# EasyEDA Pro project ProProject_stm32F103c8t6_car_board_2024-08-25.epro

# Schematic Schematic1
Create Date: 2024-07-04; Page Name: P1; Project Name: stm32F103c8t6_car_board; Schematic Name: Schematic1; Update Date: 2024-07-08; Company: 嘉立创EDA; Page Size: A4; Version: V1.0
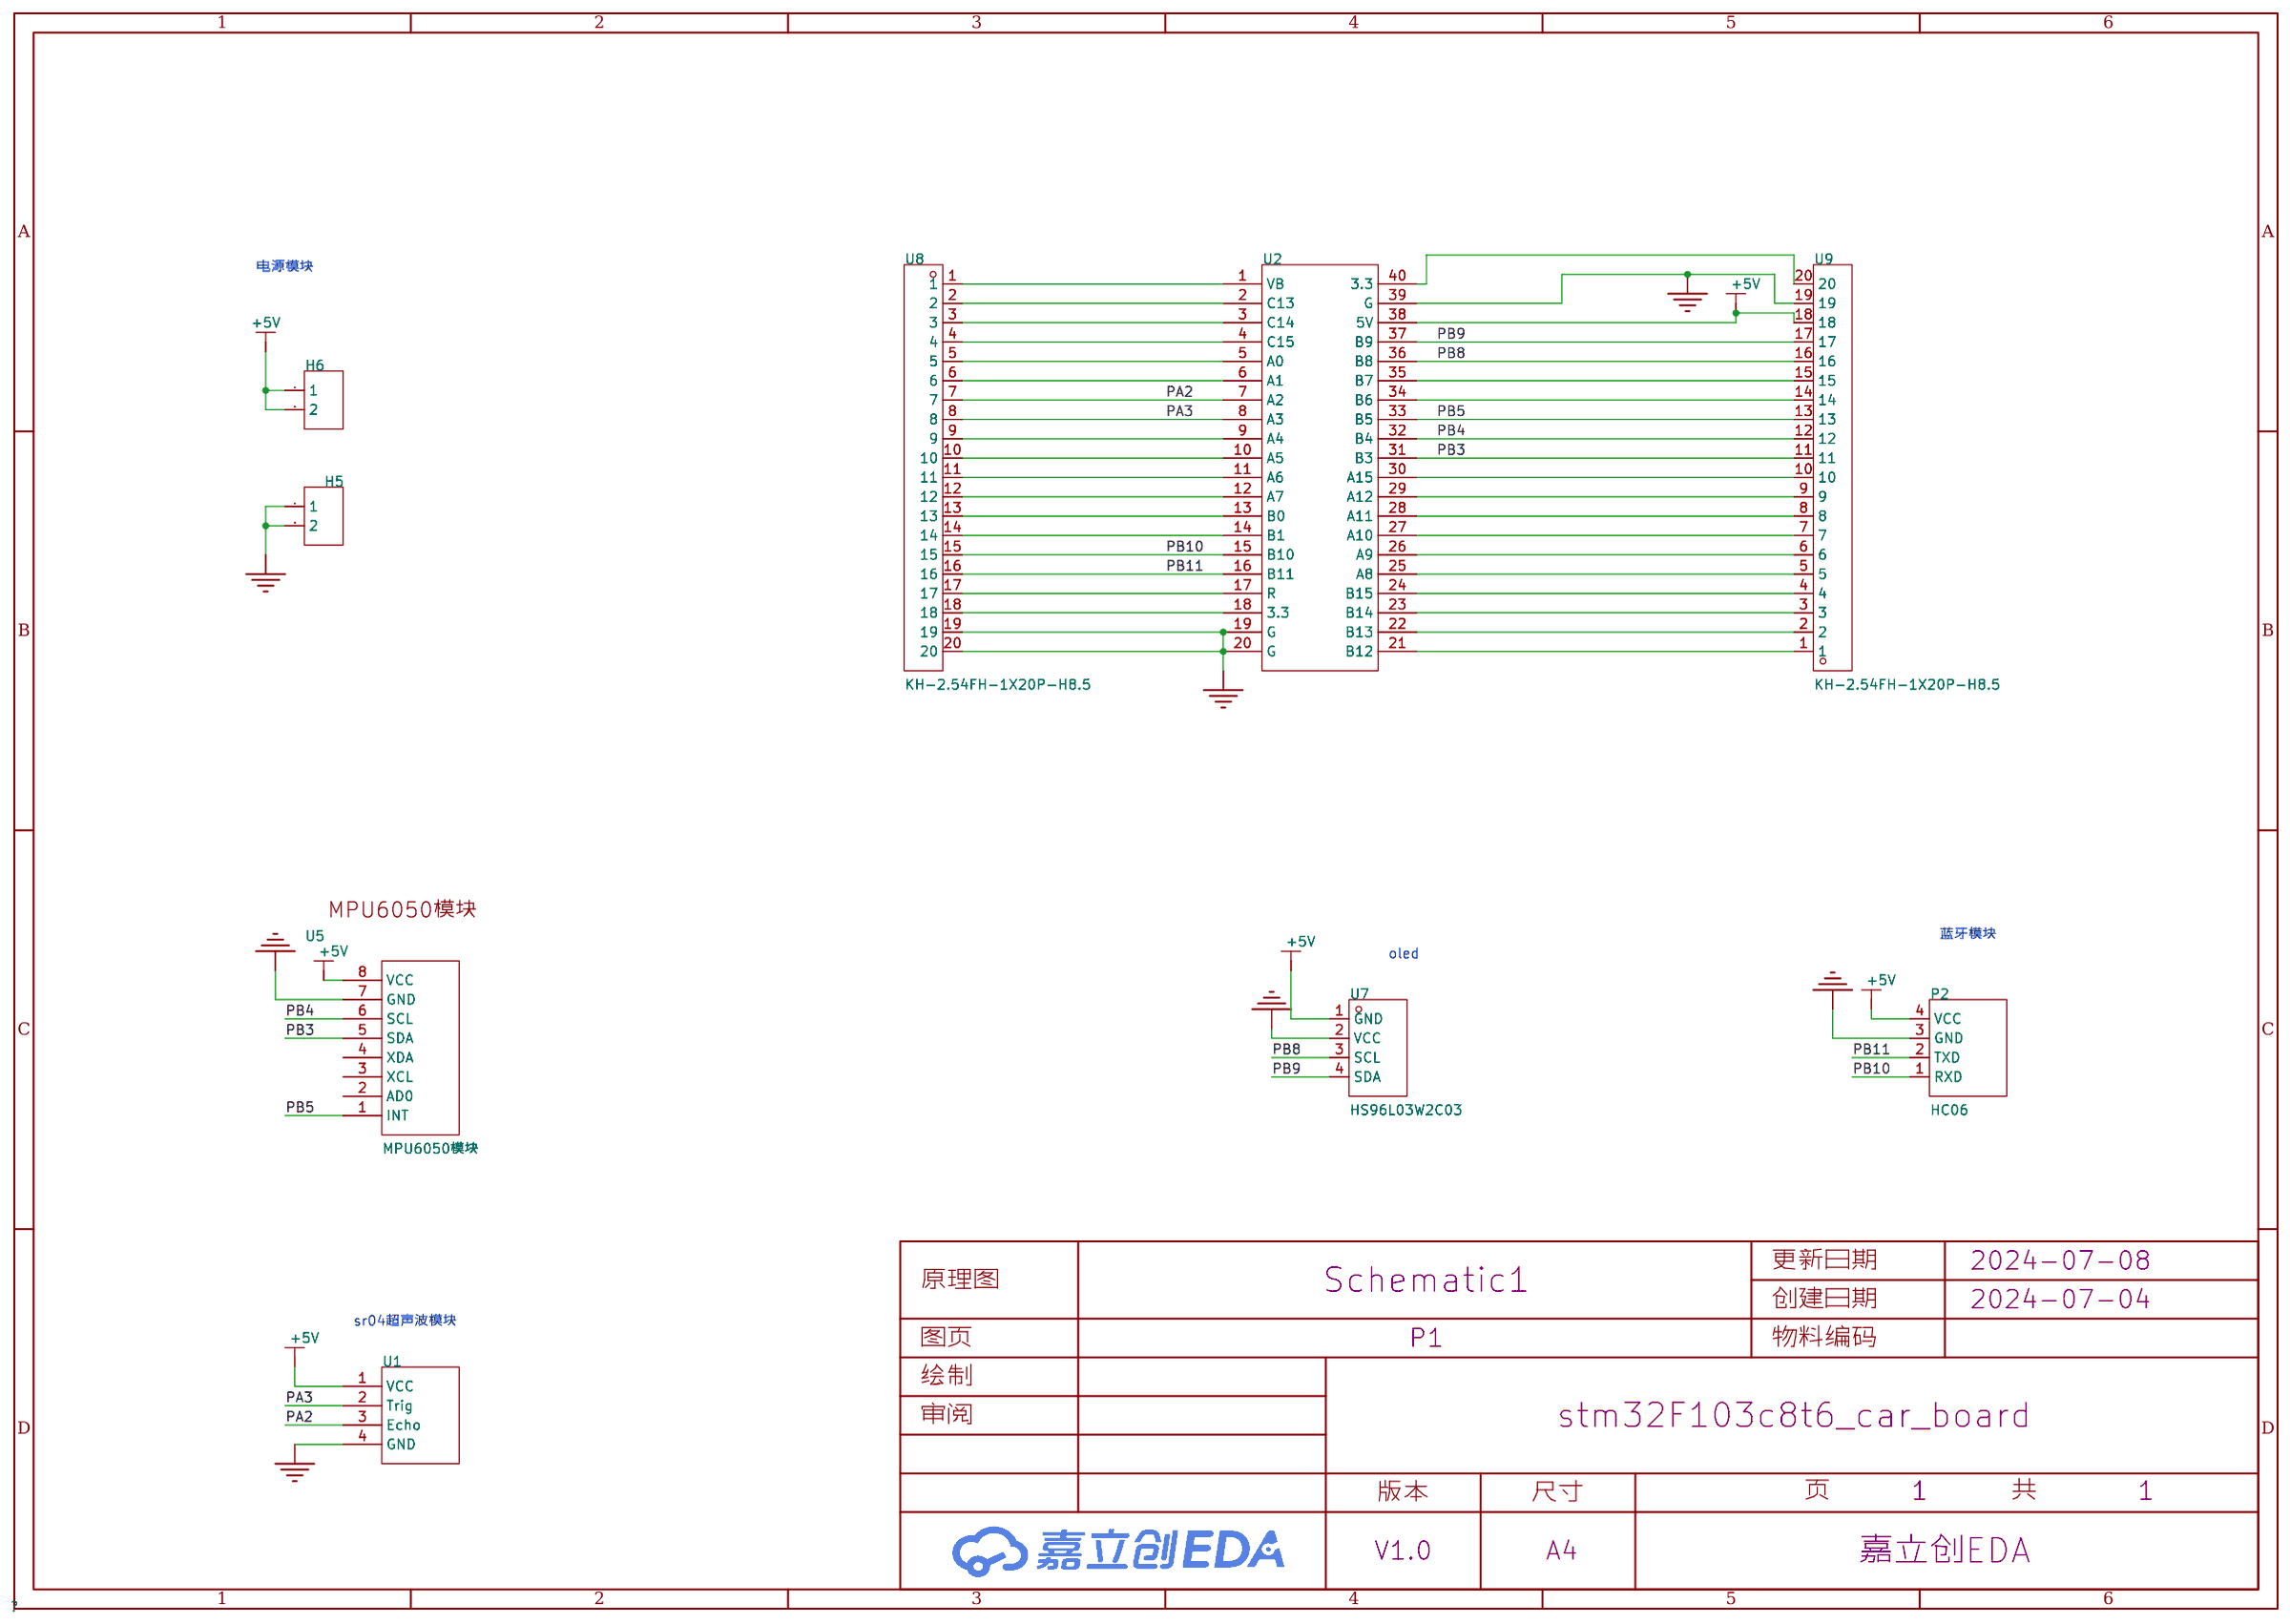
[diagram p0: schematic sheet]

## Parts
H5  -  [HDR-TH_2P-P2.54-V-F]
H6  -  [HDR-TH_2P-P2.54-V-F]
P2  HC06  [HC06]
U1  -  [HCSR04]
U2  -  [STM32C8T6]
U5  MPU6050模块  [MPU6050]
U7  HS96L03W2C03  [OLED-TH_L27.8-W27.2-P2.54_C9900033791]
U8  KH-2.54FH-1X20P-H8.5  [HDR-TH_20P-P2.54-V-F-2]
U9  KH-2.54FH-1X20P-H8.5  [HDR-TH_20P-P2.54-V-F-2]

## Library data of the parts
H5 H6 = HDR-F_2.54_1x2P: Supplier Part: C49661; Supplier Footprint: 插件
P2 = HC06: _: 3
U1 = HCSR04: _: 3
U2 = STM32C8T6
U5 = MPU6050模块
U7 = OLED-4PIN: 主控芯片:SSD1315;接口类型:I2C;尺寸(inch):0.96;像素分辨率:128x64;; LCSC Part Name: 0.96寸OLED显示屏窄白光IIC; Supplier Part: C5248080; Manufacturer: HS(汉昇); JLCPCB Part Class: 扩展库; Datasheet: https://atta.szlcsc.com/upload/public/pdf/source/20230627/763D01F79A90007632F098068C7C8AD9.pdf; Supplier: LCSC; Main Control Chip: SSD1315; Interface Type: I2C; Size: 0.96; Pixel Resolution: 128x64; Operating Temperature: -40℃~+70℃
U8 U9 = KH-2.54FH-1X20P-H8.5: 插孔结构:1x20P;间距:2.54mm;行距:-;圆孔/方孔:方孔;安装类型:直插;排数:单排;总孔位数:20P;额定电流:3A;额定电压:-;插孔方向:顶部;塑高:8.5mm;工作温度范围:-40℃~+105℃;; LCSC Part Name: 间距:2.54mm 1x20P 直插; Supplier Part: C2905423; Manufacturer: kinghelm(金航标); Supplier Footprint: 插件,P=2.54mm; JLCPCB Part Class: 扩展库; Datasheet: https://atta.szlcsc.com/upload/public/pdf/source/20211019/BDB673907948473CE61C8A1CF06C5BF5.pdf; Supplier: LCSC; Holes Structure: 1x20P; Pitch: 2.54mm; Circular Hole / Square Hole: 方孔; Mounting Type: 直插; Number of Rows: 单排; Number of Holes: 20P; Current Rating (Max): 3A; Holes Direction: 顶部; Insulation Height: 8.5mm; Operating Temperature Range: -40℃~+105℃

## Nets
+5V: H6.1 H6.2 P2.4(VCC) U1.1(VCC) U2.38(5V) U5.8(VCC) U7.1(GND) U9.18
GND: H5.1 H5.2 P2.3(GND) U1.4(GND) U2.19(G) U2.20(G) U2.39(G) U5.7(GND) U7.2(VCC) U8.19 U8.20 U9.19
PA2: U1.3(Echo) U2.7(A2) U8.7
PA3: U1.2(Trig) U2.8(A3) U8.8
PB3: U2.31(B3) U5.5(SDA) U9.11
PB4: U2.32(B4) U5.6(SCL) U9.12
PB5: U2.33(B5) U5.1(INT) U9.13
PB8: U2.36(B8) U7.3(SCL) U9.16
PB9: U2.37(B9) U7.4(SDA) U9.17
PB10: P2.1(RXD) U2.15(B10) U8.15
PB11: P2.2(TXD) U2.16(B11) U8.16
$1N3111: U2.1(VB) U8.1
$1N3114: U2.2(C13) U8.2
$1N3119: U2.3(C14) U8.3
$1N3124: U2.4(C15) U8.4
$1N3129: U2.5(A0) U8.5
$1N3134: U2.6(A1) U8.6
$1N3149: U2.9(A4) U8.9
$1N3154: U2.10(A5) U8.10
$1N3159: U2.11(A6) U8.11
$1N3164: U2.12(A7) U8.12
$1N3169: U2.13(B0) U8.13
$1N3174: U2.14(B1) U8.14
$1N3189: U2.17(R) U8.17
$1N3194: U2.18(3.3) U8.18
$1N3205: U2.40(3.3) U9.20
$1N3264: U2.35(B7) U9.15
$1N3275: U2.34(B6) U9.14
$1N3295: U2.30(A15) U9.10
$1N3300: U2.29(A12) U9.9
$1N3305: U2.28(A11) U9.8
$1N3310: U2.27(A10) U9.7
$1N3315: U2.26(A9) U9.6
$1N3323: U2.25(A8) U9.5
$1N3328: U2.24(B15) U9.4
$1N3333: U2.23(B14) U9.3
$1N3338: U2.22(B13) U9.2
$1N3350: U2.21(B12) U9.1

Not connected (* = marked no-connect by the designer): U5 2(AD0) 3(XCL) 4(XDA)

## Notes on the sheet
- 电源模块
- oled
- 蓝牙模块
- sr04超声波模块

# Board PCB2
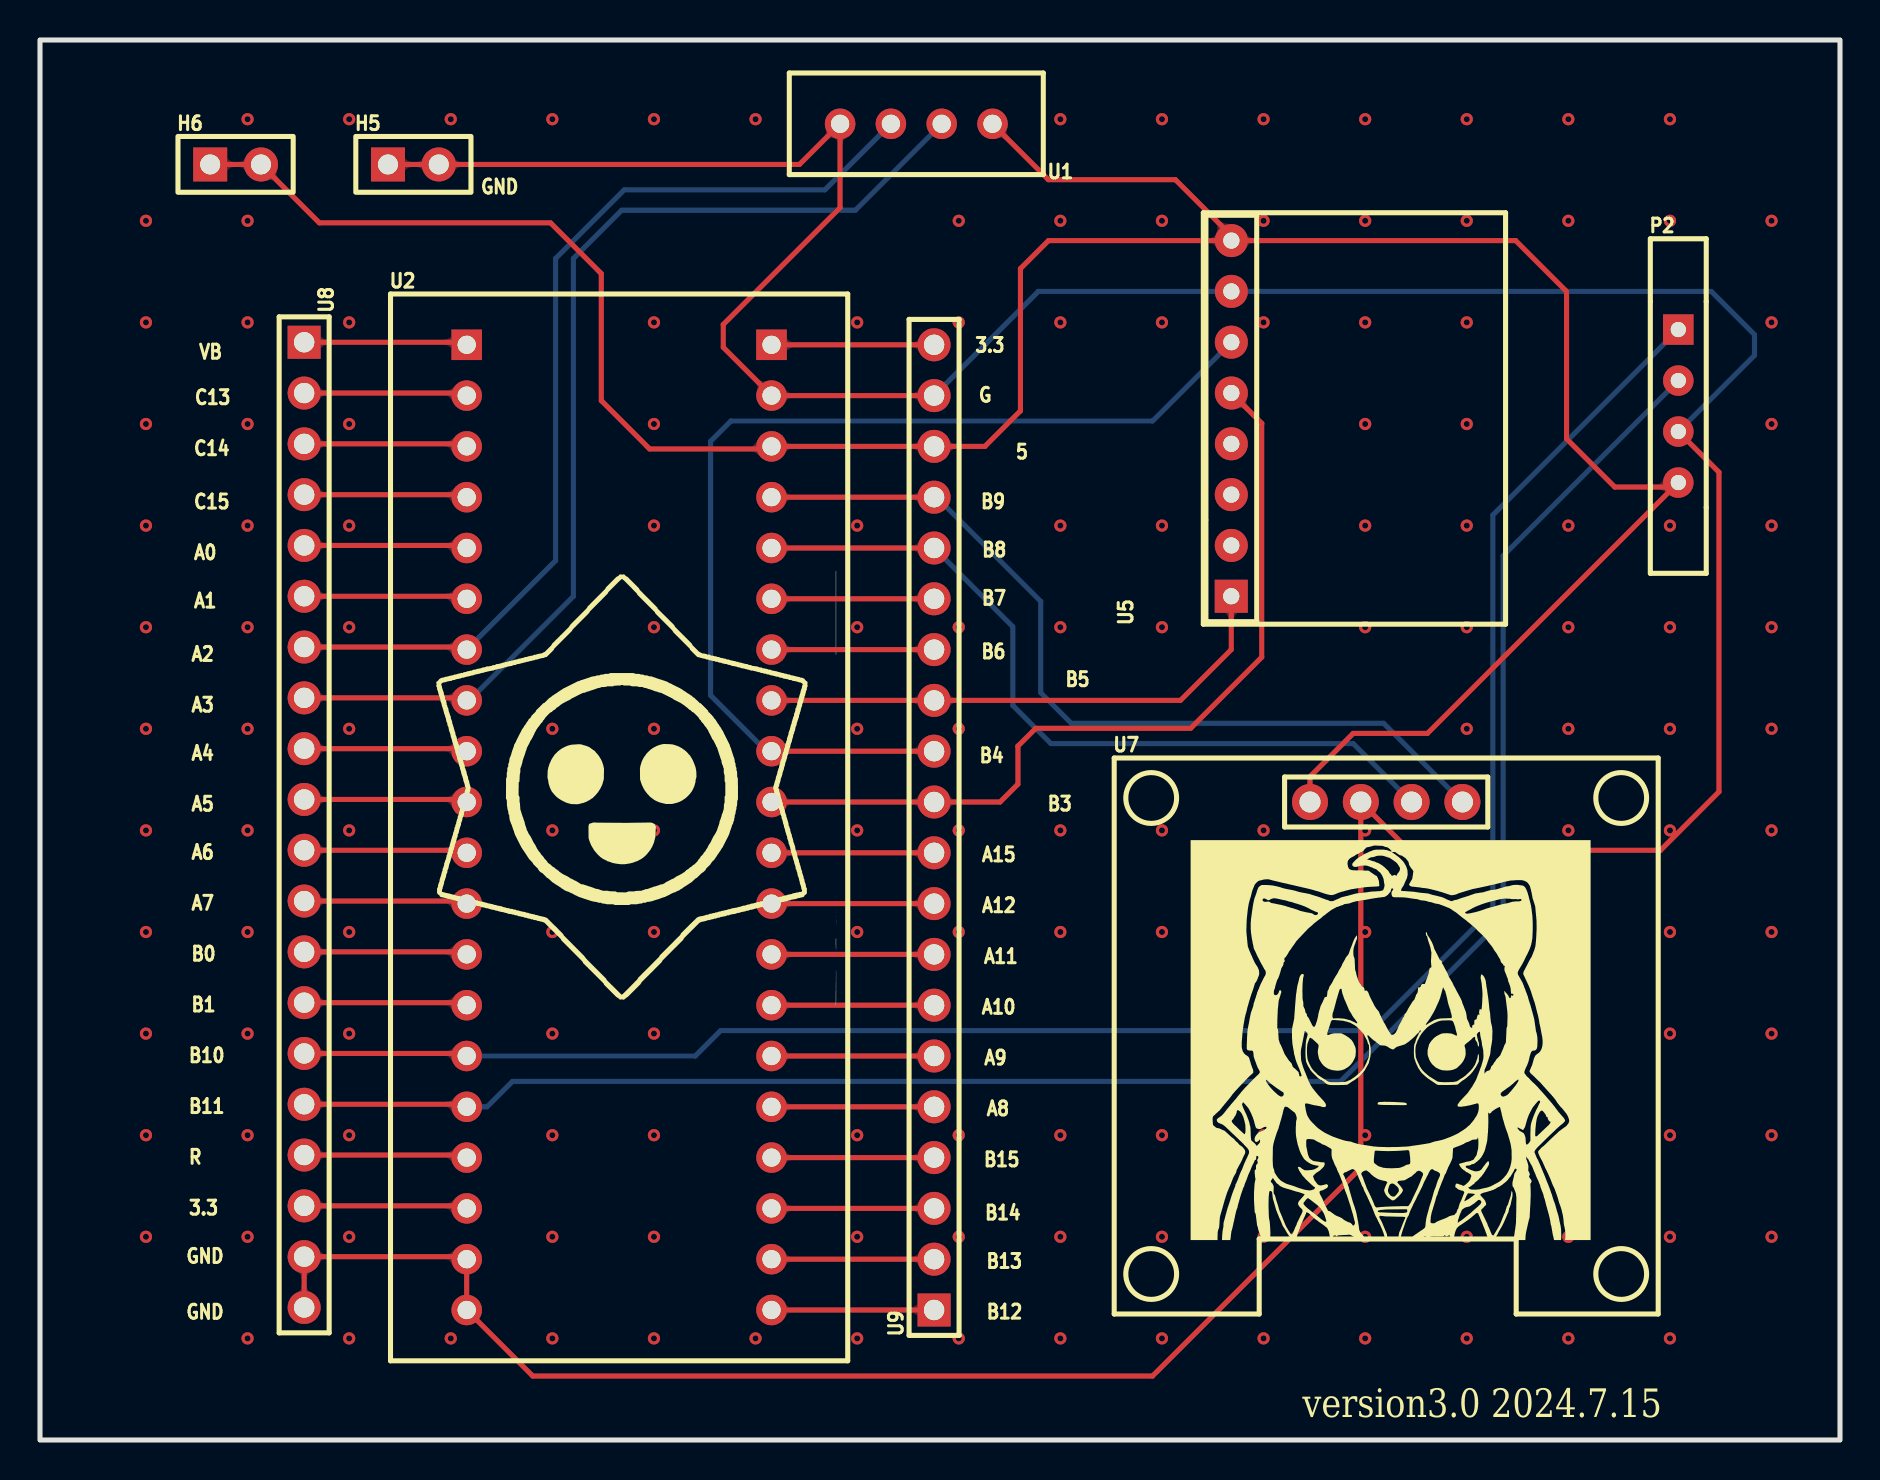
[diagram p1: board, top side]
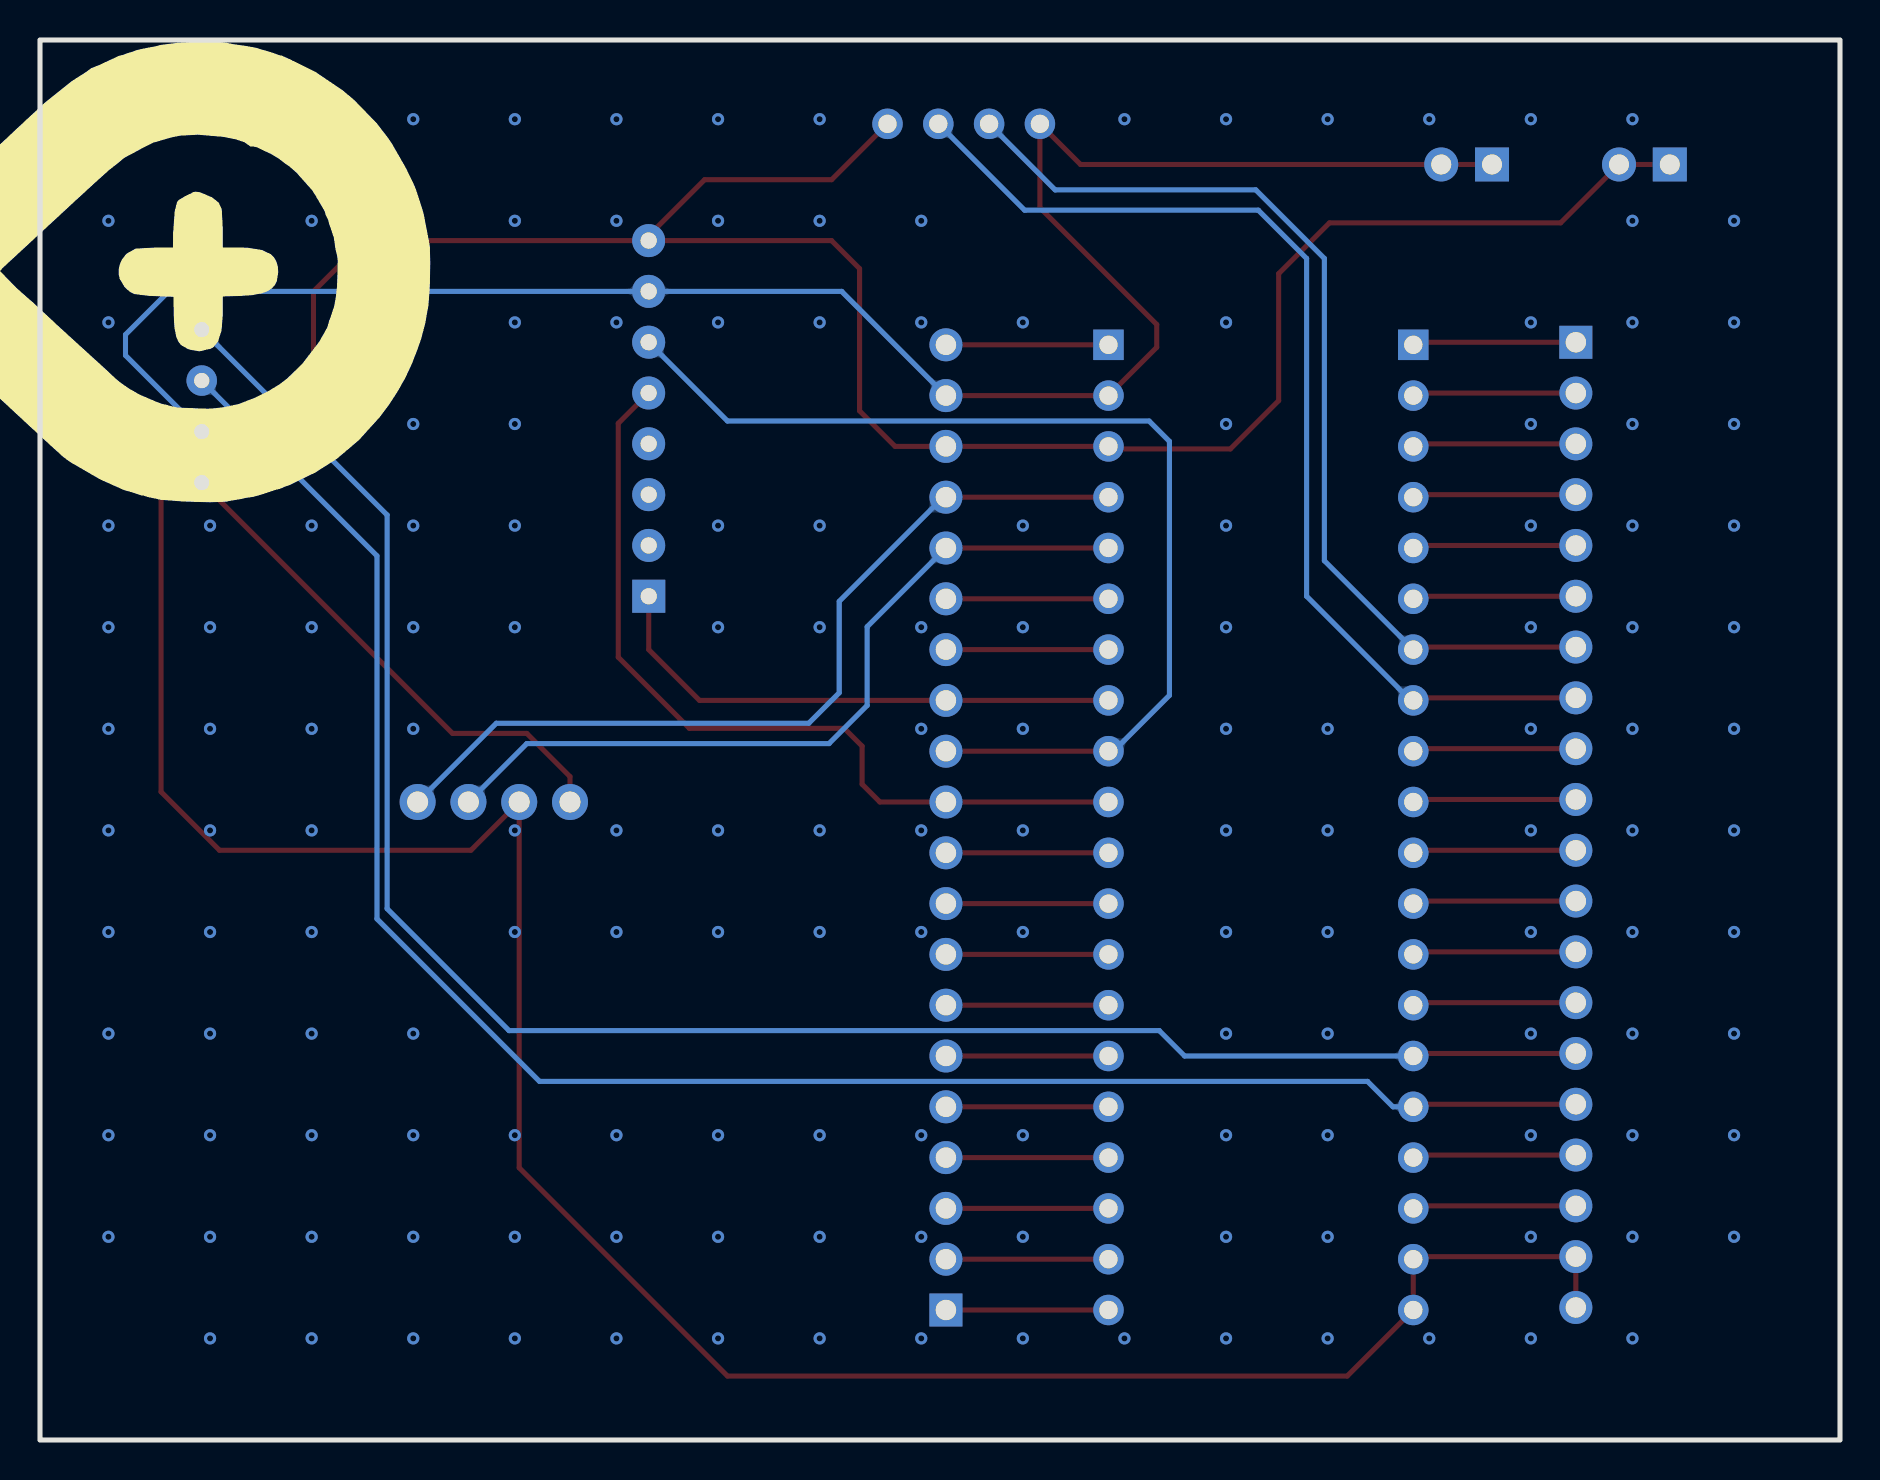
[diagram p2: board, bottom side, seen from below]

Outline 90 x 70 mm; copper layers: Top Layer, Bottom Layer. Coordinates in mm from the lower left corner of the outline.
Outline path: rectangle 0,70 90,0
Stack: Top Layer 0.035mm / Dielectric1 1.51mm FR4 er 4.5 / Bottom Layer 0.035mm

## Design rules (mm)
template: JLCPCB Capability(Two Layers Board)
spacing copperThickness1oz (default): track to track 0.102, other pairs 0.152 to 0.3
spacing copperThickness2oz: track to track 0.203, other pairs 0.152 to 0.3
track width copperThickness1oz (default): min 0.127, default 0.254, max 2.54
track width copperThickness2oz: min 0.203, default 0.254, max 2.54
differential pair differentialPair (default): width min 0.127, default 0.254, max 2.54; gap min 0.152, default 0.152
via viaSize (default): diameter min 0.5, default 0.61, max 10; hole min 0.3, default 0.305, max 6.3

## Placement (name value [footprint] x y rotation side)
H5  -  [HDR-TH_2P-P2.54-V-F]  18.67 63.78 0 top
H6  -  [HDR-TH_2P-P2.54-V-F]  9.78 63.78 0 top
P2  -  [HC06]  81.91 55.52 0 top
U1  -  [HCSR04]  47.62 65.81 180 top
U2  -  [STM32C8T6]  21.34 54.76 0 top
U5  MPU6050模块  [MPU6050]  58.17 40.79 90 top
U7  HS96L03W2C03  [OLED-TH_L27.8-W27.2-P2.54_C9900033791]  67.31 31.9 0 top
U8  KH-2.54FH-1X20P-H8.5  [HDR-TH_20P-P2.54-V-F-2]  13.21 30.76 270 top
U9  KH-2.54FH-1X20P-H8.5  [HDR-TH_20P-P2.54-V-F-2]  44.7 30.63 90 top

## Footprints (pads in the part's own frame, mm; a bottom-side part is the same pattern mirrored in y, then rotated)
HC06
  rect 1.524x1.524 hole 0.762: 1(0,0)
  round 1.524 hole 0.762: 2(0,-2.55) 3(0,-5.1) 4(0,-7.65)
HCSR04
  round 1.524 hole 0.914: 1(0,0) 2(2.54,0) 3(5.08,0) 4(7.62,0)
HDR-TH_2P-P2.54-V-F
  rect 1.7x1.7 hole 1: 1(-1.27,0)
  round 1.7 hole 1: 2(1.27,0)
HDR-TH_20P-P2.54-V-F-2
  rect 1.65x1.65 hole 1.02: 1(-24.13,0)
  round 1.65 hole 1.02: 2(-21.59,0) 3(-19.05,0) 4(-16.51,0) 5(-13.97,0) 6(-11.43,0) 7(-8.89,0) 8(-6.35,0) 9(-3.81,0) 10(-1.27,0) 11(1.27,0) 12(3.81,0) 13(6.35,0) 14(8.89,0) 15(11.43,0) 16(13.97,0) 17(16.51,0) 18(19.05,0) 19(21.59,0) 20(24.13,0)
MPU6050
  rect 1.651x1.651 hole 0.81: 1(1.397,-1.397)
  round 1.651 hole 0.81: 2(3.938,-1.399) 3(6.478,-1.399) 4(9.021,-1.401) 5(11.56,-1.401) 6(14.101,-1.401) 7(16.64,-1.401) 8(19.18,-1.401)
OLED-TH_L27.8-W27.2-P2.54_C9900033791
  round 1.8 hole 1.05: 1(-3.81,0) 2(-1.27,0) 3(1.27,0) 4(3.81,0)
STM32C8T6
  rect 1.524x1.524 hole 0.914: 1(0,0) 40(15.24,0)
  round 1.524 hole 0.914: 2(0,-2.54) 3(0,-5.08) 4(0,-7.62) 5(0,-10.16) 6(0,-12.7) 7(0,-15.24) 8(0,-17.78) 9(0,-20.32) 10(0,-22.86) 11(0,-25.4) 12(0,-27.94) 13(0,-30.48) 14(0,-33.02) 15(0,-35.56) 16(0,-38.1) 17(0,-40.64) 18(0,-43.18) 19(0,-45.72) 20(0,-48.26) 21(15.24,-48.26) 22(15.24,-45.72) 23(15.24,-43.18) 24(15.24,-40.64) 25(15.24,-38.1) 26(15.24,-35.56) 27(15.24,-33.02) 28(15.24,-30.48) 29(15.24,-27.94) 30(15.24,-25.4) 31(15.24,-22.86) 32(15.24,-20.32) 33(15.24,-17.78) 34(15.24,-15.24) 35(15.24,-12.7) 36(15.24,-10.16) 37(15.24,-7.62) 38(15.24,-5.08) 39(15.24,-2.54)

## Nets
As in the schematic.

Pads without a net: U5 2 3 4

## Via types
v1: diameter 0.61, hole 0.304, Top Layer to Bottom Layer, 161 vias

## Routing (per net, layer and track width the routed paths; a pad name or vN(x,y) marks a point on that pad's centre or on a via; arc(x,y) is an arc through that point)
+5V: length 141
  Top Layer w0.254: U1.1 50.42,63.02 56.77,63.02 59.57,60.22 U5.8 ; 81.69,47.65 69.37,35.33 65.66,35.33 63.5,33.17 U7.1 ; 81.69,47.65 P2.4 ; 81.69,47.65 78.74,47.65 76.33,50.06 76.33,57.43 73.78,59.97 U5.8 ; U5.8 50.42,59.97 49.02,58.57 49.02,51.46 47.24,49.68 U9.18 U2.38 36.45,49.55 30.48,49.55 28.07,51.97 28.07,58.32 25.53,60.86 13.97,60.86 H6.2 H6.1
GND: length 220
  Top Layer w0.254: U9.19 U2.39 34.16,54.63 34.16,55.78 40,61.62 U1.4 37.97,63.78 H5.2 H5.1 ; P2.3 83.95,48.39 83.95,32.41 81.03,29.49 68.45,29.49 U7.2 66.04,13.61 55.63,3.2 24.64,3.2 U2.20 U2.19 21.21,9.17 U8.19 U8.20
  Bottom Layer w0.254: U9.19 49.91,57.43 U5.7 83.56,57.43 85.72,55.27 85.72,54.23 P2.3
  vias: v1(5.3,60.96) v1(5.3,55.88) v1(5.3,50.8) v1(5.3,45.72) v1(5.3,40.64) v1(5.3,35.56) v1(5.3,30.48) v1(5.3,25.4) v1(5.3,20.32) v1(5.3,15.24) v1(5.3,10.16) v1(10.38,66.04) v1(10.38,60.96) v1(10.38,55.88) v1(10.38,50.8) v1(10.38,45.72) v1(10.38,40.64) v1(10.38,35.56) v1(10.38,30.48) v1(10.38,25.4) v1(10.38,20.32) v1(10.38,15.24) v1(10.38,10.16) v1(10.38,5.08) v1(15.46,66.04) v1(15.46,55.88) v1(15.46,50.8) v1(15.46,45.72) v1(15.46,40.64) v1(15.46,35.56) v1(15.46,30.48) v1(15.46,25.4) v1(15.46,20.32) v1(15.46,15.24) v1(15.46,10.16) v1(15.46,5.08) v1(20.54,66.04) v1(20.54,5.08) v1(25.62,66.04) v1(25.62,35.56) v1(25.62,30.48) v1(25.62,25.4) v1(25.62,20.32) v1(25.62,15.24) v1(25.62,10.16) v1(25.62,5.08) v1(30.7,66.04) v1(30.7,55.88) v1(30.7,50.8) v1(30.7,45.72) v1(30.7,40.64) v1(30.7,35.56) v1(30.7,30.48) v1(30.7,25.4) v1(30.7,20.32) v1(30.7,15.24) v1(30.7,10.16) v1(30.7,5.08) v1(35.78,66.04) v1(35.78,5.08) v1(40.86,55.88) v1(40.86,45.72) v1(40.86,40.64) v1(40.86,35.56) v1(40.86,30.48) v1(40.86,25.4) v1(40.86,15.24) v1(40.86,10.16) v1(40.86,5.08) v1(45.94,60.96) v1(45.94,55.88) v1(45.94,40.64) v1(45.94,35.56) v1(45.94,30.48) v1(45.94,25.4) v1(45.94,15.24) v1(45.94,10.16) v1(45.94,5.08) v1(51.02,66.04) v1(51.02,60.96) v1(51.02,55.88) v1(51.02,45.72) v1(51.02,40.64) v1(51.02,30.48) v1(51.02,25.4) v1(51.02,15.24) v1(51.02,10.16) v1(51.02,5.08) v1(56.1,66.04) v1(56.1,60.96) v1(56.1,55.88) v1(56.1,45.72) v1(56.1,40.64) v1(56.1,30.48) v1(56.1,25.4) v1(56.1,15.24) v1(56.1,10.16) v1(56.1,5.08) v1(61.18,66.04) v1(61.18,60.96) v1(61.18,55.88) v1(61.18,30.48) v1(61.18,25.4) v1(61.18,15.24) v1(61.18,10.16) v1(61.18,5.08) v1(66.26,66.04) v1(66.26,60.96) v1(66.26,55.88) v1(66.26,50.8) v1(66.26,45.72) v1(66.26,40.64) v1(66.26,30.48) v1(66.26,25.4) v1(66.26,15.24) v1(66.26,10.16) v1(66.26,5.08) v1(71.34,66.04) v1(71.34,60.96) v1(71.34,55.88) v1(71.34,50.8) v1(71.34,45.72) v1(71.34,40.64) v1(71.34,35.56) v1(71.34,20.32) v1(71.34,15.24) v1(71.34,10.16) v1(71.34,5.08) v1(76.42,66.04) v1(76.42,60.96) v1(76.42,45.72) v1(76.42,40.64) v1(76.42,35.56) v1(76.42,30.48) v1(76.42,25.4) v1(76.42,20.32) v1(76.42,15.24) v1(76.42,10.16) v1(76.42,5.08) v1(81.5,66.04) v1(81.5,60.96) v1(81.5,45.72) v1(81.5,40.64) v1(81.5,35.56) v1(81.5,30.48) v1(81.5,25.4) v1(81.5,20.32) v1(81.5,15.24) v1(81.5,10.16) v1(81.5,5.08) v1(86.58,60.96) v1(86.58,55.88) v1(86.58,50.8) v1(86.58,45.72) v1(86.58,40.64) v1(86.58,35.56) v1(86.58,30.48) v1(86.58,25.4) v1(86.58,20.32) v1(86.58,15.24) v1(86.58,10.16)
PA2: length 49.1
  Top Layer w0.254: U8.7 21.21,39.65 U2.7
  Bottom Layer w0.254: U2.7 25.78,43.97 25.78,59.08 29.21,62.51 39.24,62.51 U1.3
PA3: length 53.8
  Top Layer w0.254: U2.8 21.21,37.11 U8.8
  Bottom Layer w0.254: U2.8 21.46,36.98 26.67,42.19 26.67,59.08 29.08,61.49 40.77,61.49 U1.2
PB3: length 42.5
  Top Layer w0.254: U2.31 U9.11 48.01,31.9 48.9,32.79 48.9,34.69 49.78,35.58 57.53,35.58 61.09,39.14 61.09,50.83 U5.5
PB4: length 53.1
  Top Layer w0.254: U2.32 U9.12
  Bottom Layer w0.254: U5.6 55.63,50.95 34.54,50.95 33.53,49.93 33.53,37.23 36.32,34.44 U2.32
PB5: length 26.7
  Top Layer w0.254: U2.33 U9.13 57.02,36.98 59.56,39.52 U5.1
PB8: length 39.6
  Top Layer w0.254: U2.36 U9.16
  Bottom Layer w0.254: U9.16 48.64,40.66 48.64,36.73 50.55,34.82 65.66,34.82 U7.3
PB9: length 43.5
  Top Layer w0.254: U2.37 U9.17
  Bottom Layer w0.254: U7.4 67.18,35.84 51.56,35.84 50.04,37.36 50.04,41.93 44.83,47.14 U9.17
PB10: length 95.3
  Top Layer w0.254: U2.15 21.21,19.33 U8.15
  Bottom Layer w0.254: P2.1 72.64,46.25 72.64,26.57 66.55,20.47 34.04,20.47 32.77,19.2 U2.15
PB11: length 94.4
  Top Layer w0.254: U2.16 21.21,16.79 U8.16
  Bottom Layer w0.254: U2.16 22.35,16.66 23.62,17.93 65.02,17.93 73.15,26.06 73.15,44.21 P2.2
$1N3111: length 8.2
  Top Layer w0.254: U2.1 21.21,54.89 U8.1
$1N3114: length 8.2
  Top Layer w0.254: U8.2 21.21,52.35 U2.2
$1N3119: length 8.2
  Top Layer w0.254: U8.3 21.21,49.81 U2.3
$1N3124: length 8.2
  Top Layer w0.254: U2.4 21.21,47.27 U8.4
$1N3129: length 8.2
  Top Layer w0.254: U8.5 21.21,44.73 U2.5
$1N3134: length 8.2
  Top Layer w0.254: U2.6 21.21,42.19 U8.6
$1N3149: length 8.2
  Top Layer w0.254: U2.9 21.21,34.57 U8.9
$1N3154: length 8.2
  Top Layer w0.254: U2.10 21.21,32.03 U8.10
$1N3159: length 8.2
  Top Layer w0.254: U2.11 21.21,29.49 U8.11
$1N3164: length 8.2
  Top Layer w0.254: U8.12 21.21,26.95 U2.12
$1N3169: length 8.2
  Top Layer w0.254: U2.13 21.21,24.41 U8.13
$1N3174: length 8.2
  Top Layer w0.254: U2.14 21.21,21.87 U8.14
$1N3189: length 8.2
  Top Layer w0.254: U8.17 21.21,14.25 U2.17
$1N3194: length 8.2
  Top Layer w0.254: U2.18 21.21,11.71 U8.18
$1N3205: length 8.1
  Top Layer w0.254: U2.40 U9.20
$1N3264: length 8.1
  Top Layer w0.254: U2.35 U9.15
$1N3275: length 8.1
  Top Layer w0.254: U2.34 U9.14
$1N3295: length 8.1
  Top Layer w0.254: U2.30 U9.10
$1N3300: length 8.1
  Top Layer w0.254: U2.29 U9.9
$1N3305: length 8.1
  Top Layer w0.254: U2.28 U9.8
$1N3310: length 8.1
  Top Layer w0.254: U2.27 U9.7
$1N3315: length 8.1
  Top Layer w0.254: U2.26 U9.6
$1N3323: length 8.1
  Top Layer w0.254: U2.25 U9.5
$1N3328: length 8.1
  Top Layer w0.254: U2.24 U9.4
$1N3333: length 8.1
  Top Layer w0.254: U2.23 U9.3
$1N3338: length 8.1
  Top Layer w0.254: U2.22 U9.2
$1N3350: length 8.1
  Top Layer w0.254: U2.21 U9.1

## Copper pours and planes (outline as drawn; the poured copper is in the pictures)
GND on Top Layer: 0,70 90,70 90,0 0,0
GND on Bottom Layer: 0.22,70 90,70 90,0 0.22,0

Small or netless copper shapes (teardrops, artwork), in the pictures only: 100 on Top Layer, 18 on Bottom Layer

## Text on the board
Top Silkscreen Layer: GND | B10 | B11 | R | 3.3 | A2 | A3 | A4 | A5 | A6 | A7 | B0 | B1 | C14 | C15 | A0 | A1 | C13 | VB | G | B4 | B9 | B6 | A10 | B7 | A15 | A12 | B8 | A11 | B15 | A9 | B14 | B13 | A8 | B12 | 5 | B3 | B5 | version3.0 2024.7.15
